# Altium project PJ1301-001-A1.PrjPCB (part 2 of 2)
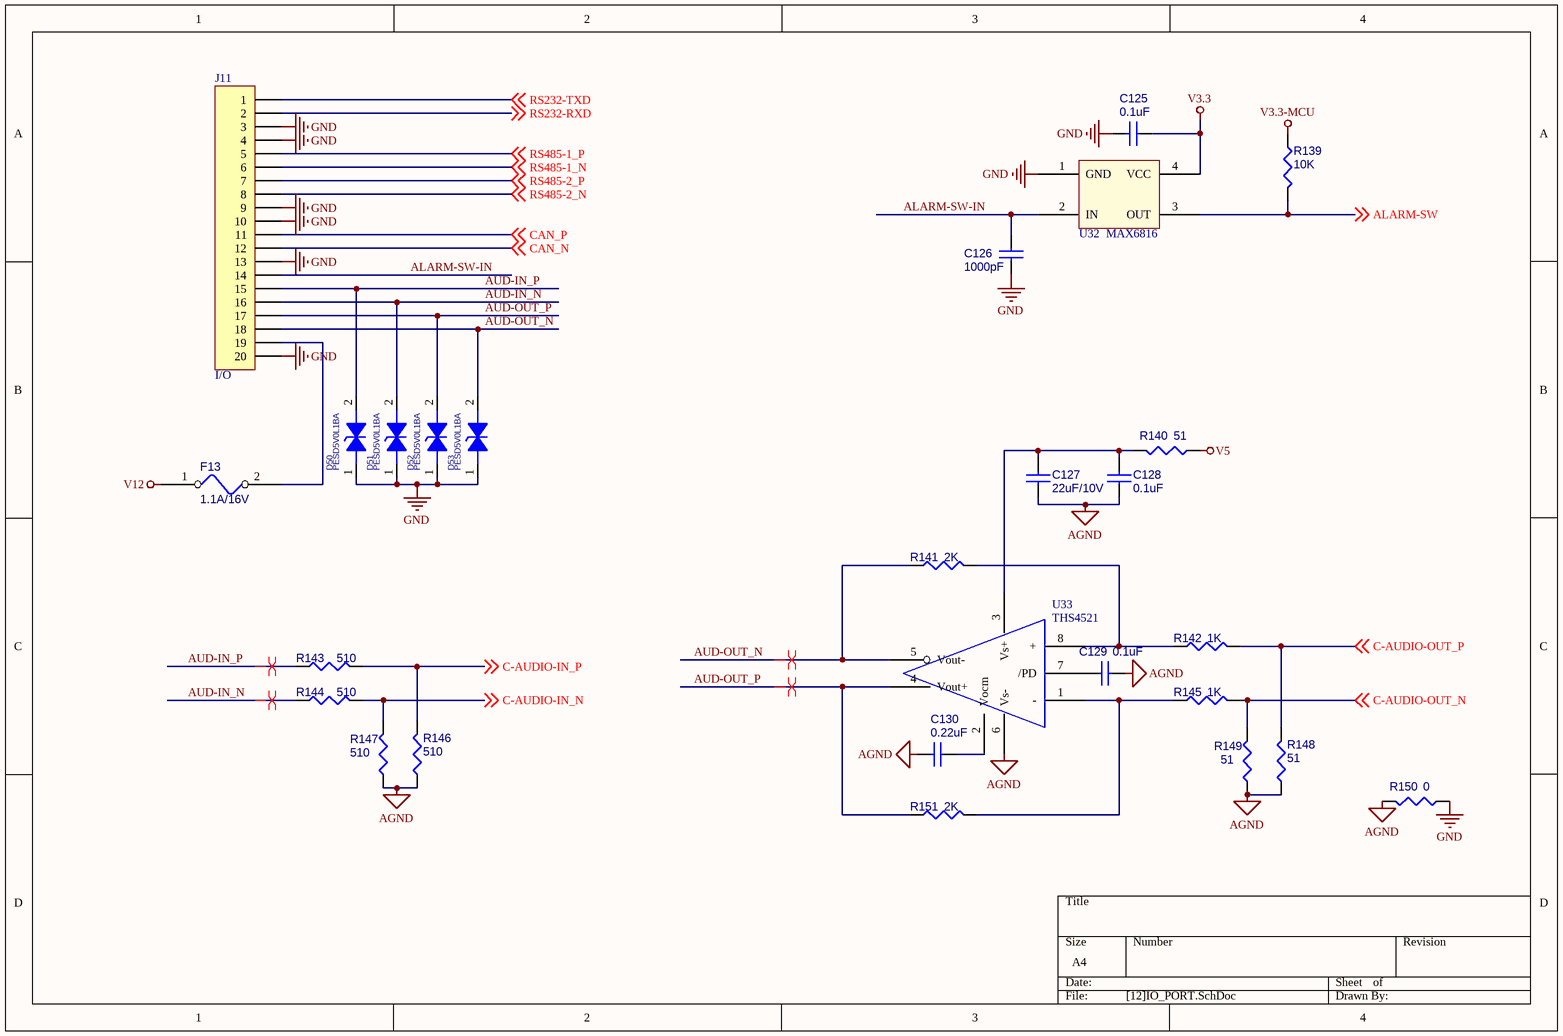
[diagram p12: [12]IO_PORT.SchDoc]

## Nets that join several sheets
AGND: [07]COMM_BOARD (M2.14 M2.15), [12]IO_PORT (10 pins)
CELLULAR-PWR: [01]POWER (C38.1 L4.2 R34.1), [07]COMM_BOARD (M2.1 M2.2 M2.3 M2.4)
GND: [01]POWER (66 pins), [02]MCU (16 pins), [03]CORE_BOARD (39 pins), [04]STORAGE (16 pins), [05]USB_HUB (27 pins), [06]EXT_UART (18 pins), [07]COMM_BOARD (10 pins), [08]CAN (25 pins), [09]SERIAL_PORT (19 pins), [10]MISC (18 pins), [11]VIDEO_PORT (40 pins), [12]IO_PORT (14 pins)
V3.3: [01]POWER (C16.1 L1.2 R14.1), [04]STORAGE (17 pins), [05]USB_HUB (15 pins), [06]EXT_UART (32 pins), [07]COMM_BOARD (6 pins), [08]CAN (24 pins), [09]SERIAL_PORT (C101.1 C107.1 U23.16 U25.16), [10]MISC (C112.2 R158.2 U27.4), [11]VIDEO_PORT (8 pins), [12]IO_PORT (C125.1 U32.4)
V3.3-MCU: [01]POWER (7 pins), [02]MCU (22 pins), [07]COMM_BOARD (R97.2 R100.2), [08]CAN (R106.1), [10]MISC (D27.2), [11]VIDEO_PORT (R134.1), [12]IO_PORT (R139.1)
V5: [01]POWER (C26.1 L2.2 R20.1), [03]CORE_BOARD (9 pins), [04]STORAGE (D22.5 F2.2), [08]CAN (C90.2 U19.3), [09]SERIAL_PORT (6 pins), [10]MISC (C113.1 D26.5 U26.7), [11]VIDEO_PORT (D40.1 K1.9), [12]IO_PORT (R140.2)
V12: [01]POWER (13 pins), [11]VIDEO_PORT (9 pins), [12]IO_PORT (F13.1)
485-EN: [03]CORE_BOARD (M1.A32), [09]SERIAL_PORT (R122.1 U22.2 U22.3)
AIN1: [03]CORE_BOARD (M1.C31), [11]VIDEO_PORT (D31.2 J8.8)
AIN2: [03]CORE_BOARD (M1.C27), [11]VIDEO_PORT (D32.2 J8.12)
AIN3: [03]CORE_BOARD (M1.C23), [11]VIDEO_PORT (D33.2 J8.16)
AIN4: [03]CORE_BOARD (M1.C19), [11]VIDEO_PORT (D34.2 J10.2)
AIN5: [03]CORE_BOARD (M1.C15), [11]VIDEO_PORT (D41.2 J10.6)
AIN6: [03]CORE_BOARD (M1.C11), [11]VIDEO_PORT (D42.2 J10.10)
AIN7: [03]CORE_BOARD (M1.C7), [11]VIDEO_PORT (D43.2 J10.14)
AIN8: [03]CORE_BOARD (M1.C3), [11]VIDEO_PORT (D44.2 J10.18)
ALARM-SW: [02]MCU (U7.40), [12]IO_PORT (R139.2 U32.3)
AOUT: [03]CORE_BOARD (M1.C35), [11]VIDEO_PORT (D30.2 J8.19)
C-AUDIO-IN_N: [07]COMM_BOARD (M2.9), [12]IO_PORT (R144.1 R147.1)
C-AUDIO-IN_P: [07]COMM_BOARD (M2.10), [12]IO_PORT (R143.1 R146.1)
C-AUDIO-OUT_N: [07]COMM_BOARD (M2.11), [12]IO_PORT (R145.1 R149.1)
C-AUDIO-OUT_P: [07]COMM_BOARD (M2.12), [12]IO_PORT (R142.1 R148.1)
C-PWR-CTRL: [01]POWER (R39.2 U6.2), [02]MCU (U7.37)
CAN-BOOT: [02]MCU (U7.32), [08]CAN (R106.2 U20.2)
CAN-RST: [02]MCU (U7.33), [08]CAN (R120.1)
CAN_N: [08]CAN (D25.1 U19.6), [12]IO_PORT (J11.12)
CAN_P: [08]CAN (D25.2 U19.7), [12]IO_PORT (J11.11)
CELLULAR-RESET: [02]MCU (U7.34), [07]COMM_BOARD (M2.13)
DPC-RXD: [09]SERIAL_PORT (U25.8), [11]VIDEO_PORT (J8.2)
DPC-TXD: [09]SERIAL_PORT (U25.7), [11]VIDEO_PORT (J8.1)
E0RX_N: [03]CORE_BOARD (M1.A59), [10]MISC (D29.4 J7.6)
E0RX_P: [03]CORE_BOARD (M1.A60), [10]MISC (D29.3 J7.3)
E0TX_N: [03]CORE_BOARD (M1.A57), [10]MISC (D29.1 J7.2)
E0TX_P: [03]CORE_BOARD (M1.A58), [10]MISC (D29.6 J7.1)
EBIA0: [03]CORE_BOARD (M1.B43), [06]EXT_UART (U16.24)
EBIA1: [03]CORE_BOARD (M1.B46), [06]EXT_UART (U16.23)
EBIA2: [03]CORE_BOARD (M1.B45), [06]EXT_UART (U16.22)
EBIA3: [03]CORE_BOARD (M1.B48), [06]EXT_UART (U15.2)
EBIA4: [03]CORE_BOARD (M1.B47), [06]EXT_UART (U15.3)
EBICS1: [03]CORE_BOARD (M1.B21), [06]EXT_UART (R73.1 U15.1)
EBID0: [03]CORE_BOARD (M1.B42), [06]EXT_UART (U16.53)
EBID1: [03]CORE_BOARD (M1.B40), [06]EXT_UART (U16.54)
EBID2: [03]CORE_BOARD (M1.B38), [06]EXT_UART (U16.55)
EBID3: [03]CORE_BOARD (M1.B36), [06]EXT_UART (U16.56)
EBID4: [03]CORE_BOARD (M1.B34), [06]EXT_UART (U16.57)
EBID5: [03]CORE_BOARD (M1.B32), [06]EXT_UART (U16.58)
EBID6: [03]CORE_BOARD (M1.B30), [06]EXT_UART (U16.59)
EBID7: [03]CORE_BOARD (M1.B28), [06]EXT_UART (U16.60)
EBIOE: [03]CORE_BOARD (M1.B19), [06]EXT_UART (U16.40)
EBIWE: [03]CORE_BOARD (M1.A12), [04]STORAGE (U12.18), [06]EXT_UART (U16.9)
EUARTA-INT: [03]CORE_BOARD (M1.A26), [06]EXT_UART (R87.1 U16.6)
EUARTB-INT: [03]CORE_BOARD (M1.A23), [06]EXT_UART (R88.1 U16.12)
EUARTC-INT: [03]CORE_BOARD (M1.A24), [06]EXT_UART (R89.1 U16.37)
EUARTD-INT: [03]CORE_BOARD (M1.A21), [06]EXT_UART (R90.1 U16.43)
FLASH-DB0: [03]CORE_BOARD (M1.B41), [04]STORAGE (U12.29)
FLASH-DB1: [03]CORE_BOARD (M1.B39), [04]STORAGE (U12.30)
FLASH-DB2: [03]CORE_BOARD (M1.B37), [04]STORAGE (U12.31)
FLASH-DB3: [03]CORE_BOARD (M1.B35), [04]STORAGE (U12.32)
FLASH-DB4: [03]CORE_BOARD (M1.B33), [04]STORAGE (U12.41)
FLASH-DB5: [03]CORE_BOARD (M1.B31), [04]STORAGE (U12.42)
FLASH-DB6: [03]CORE_BOARD (M1.B29), [04]STORAGE (U12.43)
FLASH-DB7: [03]CORE_BOARD (M1.B27), [04]STORAGE (U12.44)
GPRS-RXD: [03]CORE_BOARD (M1.B13), [07]COMM_BOARD (M2.6)
GPRS-TXD: [03]CORE_BOARD (M1.B14), [07]COMM_BOARD (M2.5)
GPS-PWR-CTRL: [02]MCU (U7.36), [07]COMM_BOARD (Q12.2 R100.1)
HAND-IN: [02]MCU (R50.2 U7.9), [03]CORE_BOARD (M1.A20)
HAND-OUT: [02]MCU (R49.2 U7.25), [03]CORE_BOARD (M1.B22)
I2C-SCL: [02]MCU (U7.13), [03]CORE_BOARD (M1.A37), [10]MISC (U28.6)
I2C-SDA: [02]MCU (U7.12), [03]CORE_BOARD (M1.A38), [10]MISC (U28.5)
IGN: [01]POWER (Q3.1), [02]MCU (U9.2)
NAND-ALE: [03]CORE_BOARD (M1.B26), [04]STORAGE (U12.17)
NAND-CE: [03]CORE_BOARD (M1.B24), [04]STORAGE (R53.1 U12.9)
NAND-CLE: [03]CORE_BOARD (M1.B20), [04]STORAGE (U12.16)
NAND-RDY: [03]CORE_BOARD (M1.B25), [04]STORAGE (R55.1 U12.7)
NAND-RE: [03]CORE_BOARD (M1.B17), [04]STORAGE (R54.1 U12.8)
PWR-OPEN: [01]POWER (R4.2 R157.1), [02]MCU (U7.11)
REV: [01]POWER (Q4.1), [02]MCU (U10.2)
RS232-RXD: [09]SERIAL_PORT (U25.13), [12]IO_PORT (J11.2)
RS232-TXD: [09]SERIAL_PORT (U25.14), [12]IO_PORT (J11.1)
RS485-1_N: [09]SERIAL_PORT (U22.7), [12]IO_PORT (J11.6)
RS485-1_P: [09]SERIAL_PORT (U22.6), [12]IO_PORT (J11.5)
RS485-2_N: [09]SERIAL_PORT (R127.1 U24.7), [12]IO_PORT (J11.8)
RS485-2_P: [09]SERIAL_PORT (R126.1 U24.6), [12]IO_PORT (J11.7)
SYS-RESET: [05]USB_HUB (U13.2), [06]EXT_UART (U17.2), [08]CAN (U21.2), [10]MISC (U27.2)
UART0-RXD: [03]CORE_BOARD (M1.B16), [09]SERIAL_PORT (U23.12)
UART0-TXD: [03]CORE_BOARD (M1.B15), [09]SERIAL_PORT (U23.11)
UART2-RXD: [03]CORE_BOARD (M1.A35), [07]COMM_BOARD (M2.25)
UART2-TXD: [03]CORE_BOARD (M1.A36), [07]COMM_BOARD (M2.26)
UART3-RXD: [03]CORE_BOARD (M1.A33), [09]SERIAL_PORT (R121.1)
UART3-TXD: [03]CORE_BOARD (M1.A34), [09]SERIAL_PORT (U22.4)
UART4-RXD: [06]EXT_UART (U16.62), [09]SERIAL_PORT (U25.9)
UART4-TXD: [06]EXT_UART (U16.8), [09]SERIAL_PORT (U25.10)
UART5-RXD: [06]EXT_UART (U16.20), [09]SERIAL_PORT (U25.12)
UART5-TXD: [06]EXT_UART (U16.10), [09]SERIAL_PORT (U25.11)
UART6-RXD: [06]EXT_UART (U16.29), [09]SERIAL_PORT (R124.1)
UART6-TXD: [06]EXT_UART (U16.39), [09]SERIAL_PORT (R125.1)
UART7-RXD: [06]EXT_UART (U16.51), [08]CAN (R109.1 R114.1)
UART7-TXD: [06]EXT_UART (U16.41), [08]CAN (R115.1 R116.1)
USB0_N: [03]CORE_BOARD (M1.A15), [05]USB_HUB (U14.21)
USB0_P: [03]CORE_BOARD (M1.A16), [05]USB_HUB (U14.22)
USB1_N: [03]CORE_BOARD (M1.A13), [04]STORAGE (D22.3 J3.3)
USB1_P: [03]CORE_BOARD (M1.A14), [04]STORAGE (D22.1 J3.2)
USB2_N: [05]USB_HUB (U14.28), [07]COMM_BOARD (M2.20)
USB2_P: [05]USB_HUB (U14.29), [07]COMM_BOARD (M2.19)
USB3_N: [05]USB_HUB (U14.31), [07]COMM_BOARD (M2.8)
USB3_P: [05]USB_HUB (U14.32), [07]COMM_BOARD (M2.7)
USB4_N: [05]USB_HUB (U14.34), [10]MISC (D26.1 J6.2)
USB4_P: [05]USB_HUB (U14.35), [10]MISC (D26.3 J6.3)
USBHUB-RST: [02]MCU (U7.42), [05]USB_HUB (R68.1)
VIDEO-SW: [02]MCU (U7.31), [11]VIDEO_PORT (R134.2 U30.2)
VIN1: [03]CORE_BOARD (M1.C32), [11]VIDEO_PORT (R132.2)
VIN2: [03]CORE_BOARD (M1.C28), [11]VIDEO_PORT (D37.2 J8.11)
VIN3: [03]CORE_BOARD (M1.C24), [11]VIDEO_PORT (D38.2 J8.15)
VIN4: [03]CORE_BOARD (M1.C20), [11]VIDEO_PORT (D39.2 J10.1)
VIN5: [03]CORE_BOARD (M1.C16), [11]VIDEO_PORT (D46.2 J10.5)
VIN6: [03]CORE_BOARD (M1.C12), [11]VIDEO_PORT (D47.2 J10.9)
VIN7: [03]CORE_BOARD (M1.C8), [11]VIDEO_PORT (D48.2 J10.13)
VIN8: [03]CORE_BOARD (M1.C4), [11]VIDEO_PORT (D49.2 J10.17)
VOUT: [03]CORE_BOARD (M1.C36), [11]VIDEO_PORT (K1.10)
WIFI-PWR-CTRL: [02]MCU (U7.35), [07]COMM_BOARD (Q10.2 R97.1)